# Altium schematic sheet top_new.SchDoc: Top
size A; Organization: Cal Poly Racing; engineer1: Graydon Wilson; engineer2: Jason Childers; engineer3: Haley Pierce
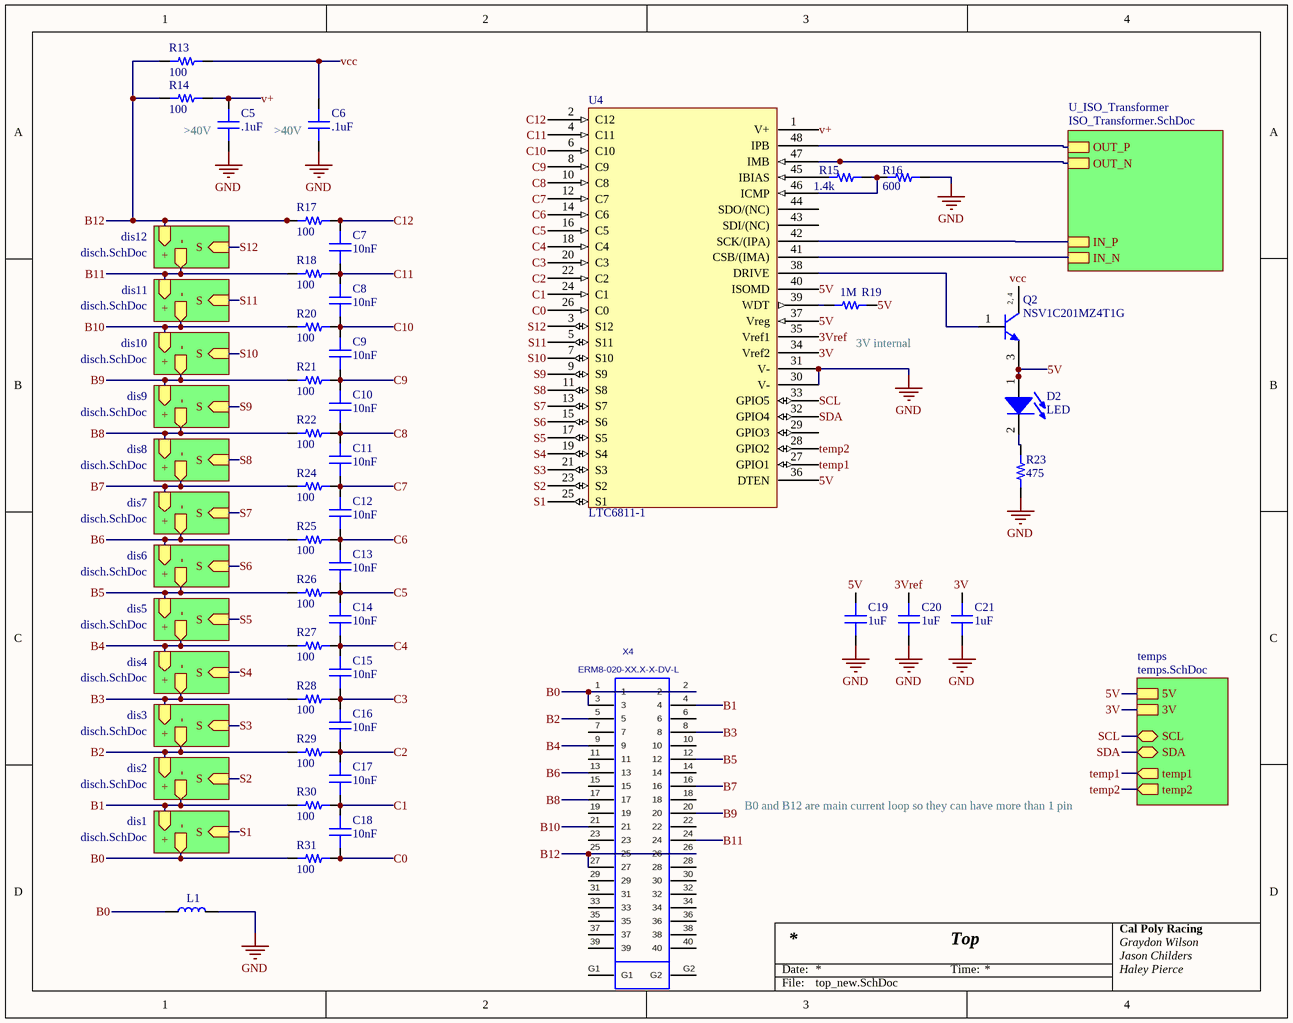
[diagram p0: top_new.SchDoc]

## Parts
C5  capacitance: .1uF  [0603]  (hidden comment: capacitor)
C6  capacitance: .1uF  [0603]  (hidden comment: capacitor)
C7  capacitance: 10nF  [0603]  (hidden comment: capacitor)
C8  capacitance: 10nF  [0603]  (hidden comment: capacitor)
C9  capacitance: 10nF  [0603]  (hidden comment: capacitor)
C10  capacitance: 10nF  [0603]  (hidden comment: capacitor)
C11  capacitance: 10nF  [0603]  (hidden comment: capacitor)
C12  capacitance: 10nF  [0603]  (hidden comment: capacitor)
C13  capacitance: 10nF  [0603]  (hidden comment: capacitor)
C14  capacitance: 10nF  [0603]  (hidden comment: capacitor)
C15  capacitance: 10nF  [0603]  (hidden comment: capacitor)
C16  capacitance: 10nF  [0603]  (hidden comment: capacitor)
C17  capacitance: 10nF  [0603]  (hidden comment: capacitor)
C18  capacitance: 10nF  [0603]  (hidden comment: capacitor)
C19  capacitance: 1uF  [0603]  (hidden comment: capacitor)
C20  capacitance: 1uF  [0603]  (hidden comment: capacitor)
C21  capacitance: 1uF  [0603]  (hidden comment: capacitor)
D2  LED  [0805_LED]
L1  MPZ1608S221ATA00  [0603]  (value not drawn)
Q2  NSV1C201MZ4T1G  [ONSC-SOT-223-4-318E-04_V]
R13  100  [RES 0805/2012]
R14  100  [RES 0805/2012]
R15  1.4k  [RES 0603/1608]
R16  600  [RES 0603/1608]
R17  100  [RES 0603/1608]
R18  100  [RES 0603/1608]
R19  1M  [RES 0603/1608]
R20  100  [RES 0603/1608]
R21  100  [RES 0603/1608]
R22  100  [RES 0603/1608]
R23  475  [RES 0805/2012]
R24  100  [RES 0603/1608]
R25  100  [RES 0603/1608]
R26  100  [RES 0603/1608]
R27  100  [RES 0603/1608]
R28  100  [RES 0603/1608]
R29  100  [RES 0603/1608]
R30  100  [RES 0603/1608]
R31  100  [RES 0603/1608]
U4  LTC6811-1  [LTC6811-1]
X4  ERM8-020-XX.X-X-DV-L  [ERM8-020-XX.X-X-DV-L]

## Sub-sheets
dis1 = disch.SchDoc: - (out), + (in), S (in)
dis2 = disch.SchDoc: - (out), + (in), S (in)
dis3 = disch.SchDoc: - (out), + (in), S (in)
dis4 = disch.SchDoc: - (out), + (in), S (in)
dis5 = disch.SchDoc: - (out), + (in), S (in)
dis6 = disch.SchDoc: - (out), + (in), S (in)
dis7 = disch.SchDoc: - (out), + (in), S (in)
dis8 = disch.SchDoc: - (out), + (in), S (in)
dis9 = disch.SchDoc: - (out), + (in), S (in)
dis10 = disch.SchDoc: - (out), + (in), S (in)
dis11 = disch.SchDoc: - (out), + (in), S (in)
dis12 = disch.SchDoc: - (out), + (in), S (in)
temps = temps.SchDoc: 5V, SCL (bidir), SDA (bidir), temp1 (out), temp2 (out), 3V
U_ISO_Transformer = ISO_Transformer.SchDoc: OUT_P, OUT_N, IN_P, IN_N

## Nets
GND: C5.1 C6.1 C19.1 C20.1 C21.1 L1.2 R16.2 R23.1 U4.30(V-) U4.31(V-)
3V: C21.2 U4.34(Vref2) ; sheet temps/3V
3Vref: C20.2 U4.35(Vref1)
5V: C19.2 D2.1(A) Q2.3(E) R19.2 U4.36(DTEN) U4.37(Vreg) U4.40(ISOMD) ; sheet temps/5V
B0: L1.1 R31.1 X4.1 X4.2 X4.3 ; sheet dis1/-
B1: R30.1 X4.4 ; sheet dis1/+, sheet dis2/-
B2: R29.1 X4.5 ; sheet dis2/+, sheet dis3/-
B3: R28.1 X4.8 ; sheet dis3/+, sheet dis4/-
B4: R27.1 X4.9 ; sheet dis4/+, sheet dis5/-
B5: R26.1 X4.12 ; sheet dis5/+, sheet dis6/-
B6: R25.1 X4.13 ; sheet dis6/+, sheet dis7/-
B7: R24.1 X4.16 ; sheet dis7/+, sheet dis8/-
B8: R22.1 X4.17 ; sheet dis8/+, sheet dis9/-
B9: R21.1 X4.20 ; sheet dis9/+, sheet dis10/-
B10: R20.1 X4.21 ; sheet dis10/+, sheet dis11/-
B11: R18.1 X4.24 ; sheet dis11/+, sheet dis12/-
B12: R13.1 R14.1 R17.1 X4.25 X4.26 X4.27 ; sheet dis12/+
C0: C18.1 R31.2 U4.26(C0)
C1: C17.1 C18.2 R30.2 U4.24(C1)
C2: C16.1 C17.2 R29.2 U4.22(C2)
C3: C15.1 C16.2 R28.2 U4.20(C3)
C4: C14.1 C15.2 R27.2 U4.18(C4)
C5: C13.1 C14.2 R26.2 U4.16(C5)
C6: C12.1 C13.2 R25.2 U4.14(C6)
C7: C11.1 C12.2 R24.2 U4.12(C7)
C8: C10.1 C11.2 R22.2 U4.10(C8)
C9: C9.1 C10.2 R21.2 U4.8(C9)
C10: C8.1 C9.2 R20.2 U4.6(C10)
C11: C7.1 C8.2 R18.2 U4.4(C11)
C12: C7.2 R17.2 U4.2(C12)
S1: U4.25(S1) ; sheet dis1/S
S2: U4.23(S2) ; sheet dis2/S
S3: U4.21(S3) ; sheet dis3/S
S4: U4.19(S4) ; sheet dis4/S
S5: U4.17(S5) ; sheet dis5/S
S6: U4.15(S6) ; sheet dis6/S
S7: U4.13(S7) ; sheet dis7/S
S8: U4.11(S8) ; sheet dis8/S
S9: U4.9(S9) ; sheet dis9/S
S10: U4.7(S10) ; sheet dis10/S
S11: U4.5(S11) ; sheet dis11/S
S12: U4.3(S12) ; sheet dis12/S
SCL: U4.33(GPIO5) ; sheet temps/SCL
SDA: U4.32(GPIO4) ; sheet temps/SDA
temp1: U4.27(GPIO1) ; sheet temps/temp1
temp2: U4.28(GPIO2) ; sheet temps/temp2
v+: C5.2 R14.2 U4.1(V+)
vcc: C6.2 Q2.2(C) Q2.4(C) R13.2
NetD2_2: D2.2(K) R23.2
NetQ2_1: Q2.1(B) U4.38(DRIVE)
NetR15_1: R15.1 U4.45(IBIAS)
NetR15_2: R15.2 R16.1 U4.46(ICMP)
NetR19_1: R19.1 U4.39(WDT)
NetU4_41: U4.41(CSB/(IMA)) ; sheet U_ISO_Transformer/IN_N
NetU4_42: U4.42(SCK/(IPA)) ; sheet U_ISO_Transformer/IN_P
NetU4_47: U4.47(IMB) ; sheet U_ISO_Transformer/OUT_N
NetU4_48: U4.48(IPB) ; sheet U_ISO_Transformer/OUT_P

Not connected (* = marked no-connect by the designer): U4 29(GPIO3) 43(SDI/(NC)) 44(SDO/(NC)); X4 6 7 10 11 14 15 18 19 22 23 28 29 30 31 32 33 34 35 36 37 38 39 40 G1 G2

## Notes on the sheet
- >40V
- (near C6) >40V
- (near R19) 3V internal
- B0 and B12 are main current loop so they can have more than 1 pin
- Date:
- Time:
- File:
- (in symbol CMP-1048-00450-1) 2, 4

## Library data of the parts
C5-C21 = 1: Generic 0603 capacitor; id: 1; voltage: 50; dielectric: Ceramic; percent tolerance: 10; name: 0603 Capacitor; ESR: 1; package: 0603; quantity: 0
D2 = 19: Generic 0805 LED; id: 19; vr: 1; name: 0805 LED; numcircuits: 1; package: 0805; quantity: 0
L1 = 10: 220 Ohms @ 100MHz 1 Power Line Ferrite Bead 0; MF: TDK; id: 10; imax: 2.20000004768372; tolerance: 0; resistance: 50mOhm; MP: MPZ1608S221ATA00; SnapEDA_Link: https://www.snapeda.com/parts/MPZ1608S221ATA00/TDK-Lambda%20Americas%20Inc/view-part/?ref=snap; Digi-Key_Part_Number: 445-1565-1-ND; Digi-Key_Purchase_URL: https://www.digikey.com/product-detail/en/tdk-corporation/MPZ1608S221ATA00/445-1565-1-ND/571895?utm_source=snapeda&utm_medium=aggregator&utm_campaign=symbol; Package: 0603; Value: *; name: MPZ1608S221ATA00; quantity: 0; link: https://www.digikey.com/product-detail/en/tdk-corporation/MPZ1608S221ATA00/445-1565-1-ND/571895; createdby: Kevin
Q2 = CMP-1048-00450-1: 100 V, 2 A, Low VCE(sat), NPN Transistor, 4-Pin SOT-223, Pb-Free, Tape and Reel; Manufacturer: On Semiconductor; IC Continuous (A): 2; Note1: 0; PackageReference: SOT-223-4-318E-04; Polarity: NPN; ComponentLink3URL: http://www.onsemi.com/pub_link/Collateral/318E-04.PDF; RoHS: TRUE; PackageDescription: 4-Pin Small Outline Transistor, Body 6.5 x 3.5 mm, Pitch 2.3 mm; DatasheetVersion: Rev. 4; Mounting Technology: Surface Mount; ComponentLink1Description: Manufacturer URL; ComponentLink1URL: http://www.onsemi.com/; PackageVersion: Rev. N, 08/2009; ComponentLink2Description: Datasheet; Packing: Tape and Reel; ComponentLink2URL: http://www.onsemi.cn/pub_link/Collateral/NSS1C201MZ4-D.PDF; ComponentLink3Description: Package Specification; PartNumber: NSV1C201MZ4T1G
R13 R14 R23 = 2: id: 2; name: 0805 Resistor; percent tolerance: 5; package: 0805; quantity: 0; createdby: Kevin
  R13 R14: resistance: 100
  R23: resistance: 475
R15-R22 R24-R31 = 1: id: 1; name: 0603 Resistor; percent tolerance: 5; package: 0603; quantity: 0
  R15: resistance: 1.4k
  R16: resistance: 600
  R17 R18 R20-R22 R24-R31: resistance: 100
  R19: resistance: 1M
U4 = 37: id: 37; vcc: 40; voltageinmax: 55; name: LTC6811-1; package: SSOP; quantity: 0; link: https://www.analog.com/media/en/technical-documentation/data-sheets/68111fb.pdf
X4 = 34: MANUFACTURER: SAMTEC; id: 34; numcontacts: 40; numrows: 2; CREATED: August 17, 2016 - Wendy Xin; PCB DECAL: ERM8-020-XX.X-X-DV-L; name: ERM8-020-XX.X-X-DV-L; quantity: 0